# Altium schematic sheet PowerB.SchDoc
size A
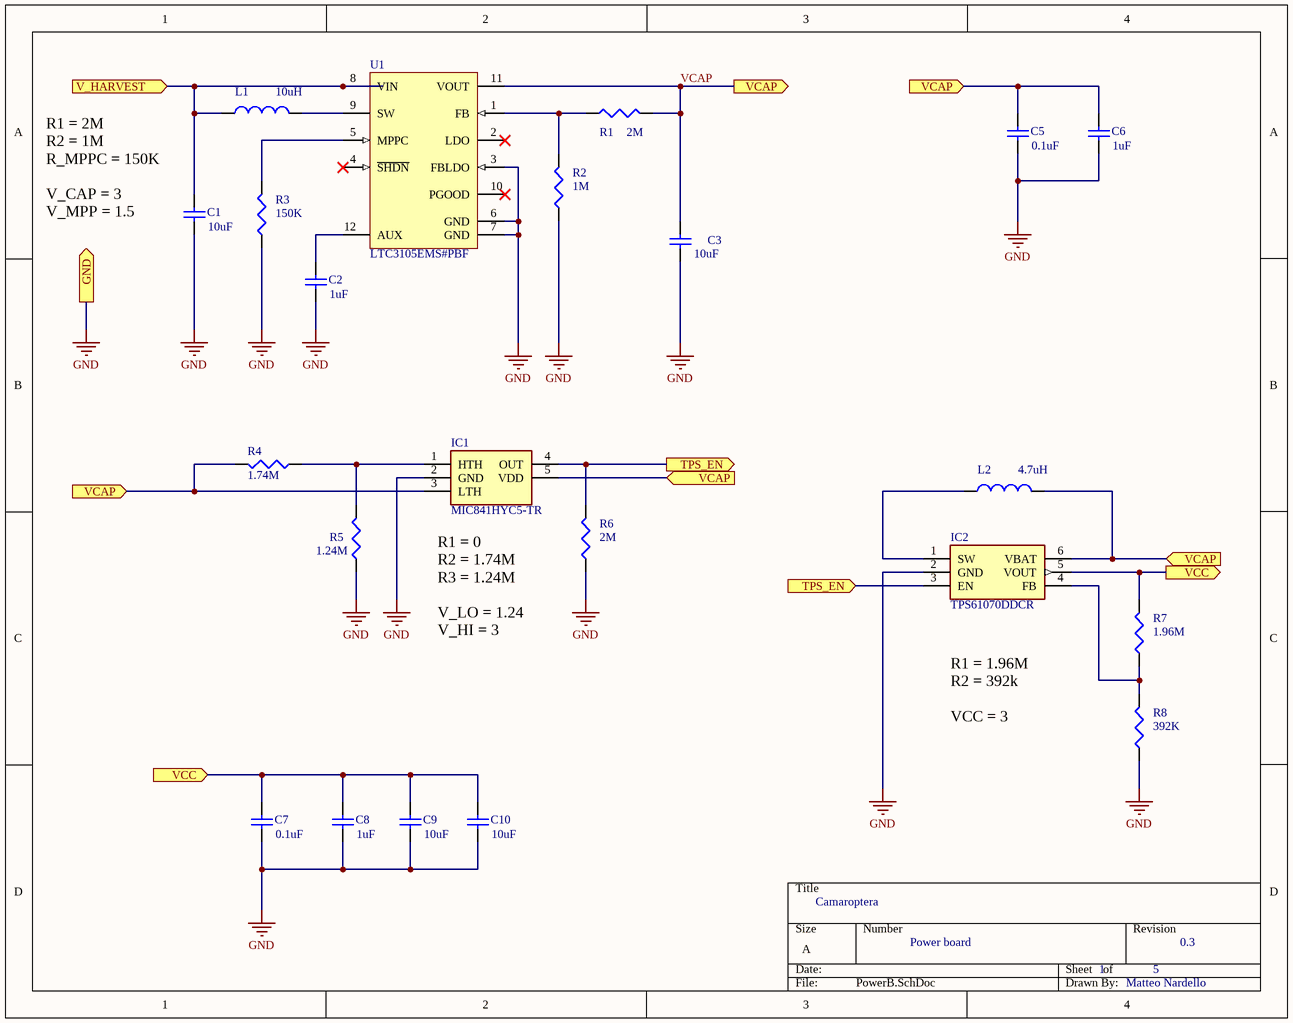
[diagram p0: PowerB.SchDoc]

## Parts
C1  value 10uF  [1608[0603]]  (hidden comment: Cap)
C2  value 1uF  [1608[0603]]  (hidden comment: Cap)
C3  value 10uF  [1608[0603]]  (hidden comment: Cap)
C5  value 0.1uF  [1608[0603]]  (hidden comment: Cap)
C6  value 1uF  [1608[0603]]  (hidden comment: Cap)
C7  value 0.1uF  [1608[0603]]  (hidden comment: Cap)
C8  value 1uF  [1608[0603]]  (hidden comment: Cap)
C9  value 10uF  [1608[0603]]  (hidden comment: Cap)
C10  value 10uF  [1608[0603]]  (hidden comment: Cap)
IC1  MIC841HYC5-TR  [SOT65P210X110-5N]
IC2  TPS61070DDCR  [SOT95P280X110-6N]
L1  value 10uH  [C1210]  (hidden comment: Inductor)
L2  value 4.7uH  [C1210]  (hidden comment: Inductor)
R1  value 2M  [1608[0603]]  (hidden comment: Res3)
R2  value 1M  [1608[0603]]  (hidden comment: Res3)
R3  value 150K  [1608[0603]]  (hidden comment: Res3)
R4  value 1.74M  [1608[0603]]  (hidden comment: Res3)
R5  value 1.24M  [1608[0603]]  (hidden comment: Res3)
R6  value 2M  [1608[0603]]  (hidden comment: Res3)
R7  value 1.96M  [1608[0603]]  (hidden comment: Res3)
R8  value 392K  [1608[0603]]  (hidden comment: Res3)
U1  LTC3105EMS#PBF  [LT-MS-12_N]

## Ports
GND (out), TPS_EN (in), TPS_EN (out), V_HARVEST (in), VCAP (in), VCAP (out), VCC (in), VCC (out)

## Nets
GND: C1.1 C2.1 C3.1 C5.1 C6.1 C7.1 C8.1 C9.1 C10.1 IC1.2(GND) IC2.2(GND) R2.1 R3.1 R5.1 R6.1 R8.1 U1.3(FBLDO) U1.6(GND) U1.7(GND) ; port GND
TPS_EN: IC1.4(OUT) IC2.3(EN) R6.2 ; port TPS_EN
V_HARVEST: C1.2 L1.1 U1.8(VIN) ; port V_HARVEST
VCAP: C3.2 C5.2 C6.2 IC1.3(LTH) IC1.5(VDD) IC2.6(VBAT) L2.2 R1.2 R4.2 U1.11(VOUT) ; port VCAP
VCC: C7.2 C8.2 C9.2 C10.2 IC2.5(VOUT) R7.2 ; port VCC
NetC2_2: C2.2 U1.12(AUX)
NetIC1_1: IC1.1(HTH) R4.1 R5.2
NetIC2_1: IC2.1(SW) L2.1
NetIC2_4: IC2.4(FB) R7.1 R8.2
NetL1_2: L1.2 U1.9(SW)
NetR1_1: R1.1 R2.2 U1.1(FB)
NetR3_2: R3.2 U1.5(MPPC)

Not connected (* = marked no-connect by the designer): U1 2(LDO)* 4(~{SHDN})* 10(PGOOD)*

## Notes on the sheet
- (near C1) R1 = 2M
  R2 = 1M
  R_MPPC = 150K
  V_CAP = 3
  V_MPP = 1.5
- R1 = 0
  R2 = 1.74M
  R3 = 1.24M
  V_LO = 1.24
  V_HI = 3
- R1 = 1.96M
  R2 = 392k
  VCC = 3
- Camaroptera
- Power board
- 1
- 5
- 0.3
- Matteo Nardello

## Library data of the parts
C1-C3 C5-C10 = Cap: CAP CER 6.3V X5R/X7R 0603; PackageReference: 0603; Publisher: Altium Limited; PackageDescription: Chip Capacitor, Body 1.6x0.8mm, IPC High Density
IC1 = MIC841HYC5-TR: Comparator with 1.25% Reference and Adjustable Hysteresis; Manufacturer_Name: Microchip; Datasheet Link: http://ww1.microchip.com/downloads/en/devicedoc/20005758a.pdf; Height: 1.1mm; Manufacturer_Part_Number: MIC841HYC5-TR; Mouser Part Number: 998-MIC841HYC5TR; RS Part Number: 1654292; RS Price/Stock: http://uk.rs-online.com/web/p/products/1654292; ComponentLink1Description: Datasheet; ComponentLink1URL: http://ww1.microchip.com/downloads/en/devicedoc/20005758a.pdf; ComponentLink2Description: Package Specification; ComponentLink2URL: http://94.251.15.129/chip/ChipDoc.nsf/Package/4907A36056EE3CAB47257B96006A2837!OpenDocument; ComponentLink3Description: Manufacturer URL; ComponentLink3URL: https://www.microchip.com
IC2 = TPS61070DDCR: 90% Efficient Synchronous Boost Converter With 600-mA Switch; Manufacturer_Name: Texas Instruments; Datasheet Link: http://www.ti.com/lit/ds/symlink/tps61070.pdf; Height: 1.1mm; Mouser Part Number: 595-TPS61070DDCR; Mouser Price/Stock: https://www.mouser.com/Search/Refine.aspx?Keyword=595-TPS61070DDCR; Manufacturer_Part_Number: TPS61070DDCR; ComponentLink1Description: Manufacturer URL; ComponentLink1URL: www.ti.com; ComponentLink2Description: Package Specification; ComponentLink2URL: http://www.ti.com/lit/ml/mpds026l/mpds026l.pdf; ComponentLink3Description: Datasheet; ComponentLink3URL: http://www.ti.com/lit/ds/symlink/tps61070.pdf
L1 = Inductor: Part: CBC3225T100KR; Code_IEC: 3225; Published: 8-Jun-2000; LatestRevisionDate: 29-May-2009; LatestRevisionNote: IPC-7351 Footprint Added.; PackageReference: 1210; Publisher: Altium Limited; PackageDescription: Chip Inductor; Code_JEITA: 1210
L2 = Inductor: Part: CBC3225T4R7MR; Code_IEC: 3225; Published: 8-Jun-2000; LatestRevisionDate: 29-May-2009; LatestRevisionNote: IPC-7351 Footprint Added.; PackageReference: 1210; Publisher: Altium Limited; PackageDescription: Chip Inductor; Code_JEITA: 1210
R1-R8 = Res3: RES 1/10W 1% 0603 SMD; PackageReference: 0603; Publisher: Altium Limited; PackageDescription: Chip Resistor, Body 1.6x0.8mm, IPC High Density
U1 = CMP-0473-00104-1: 400 mA Step-Up DC/DC Converter with Maximum Power Point Control and 250 mV Start-Up, 12-pin SOP (MS-12), -40 to 85 degC, Pb-Free; Manufacturer: Linear Technology; Number of Outputs: 1; Vin Min(V): 0.225; Topology: Boost; Vin Max(V): 5; Vout Max(V): 5.25; Energy Source: Solar; Mounting Technology: Surface Mount; PackageVersion: Rev. A, 05/2013; PartNumber: LTC3105EMS#PBF; RoHS: TRUE; PackageDescription: 12-Pin Plastic MSOP, Body 4.039 x 3 mm, Pitch 0.65 mm; ComponentLink1Description: Manufacturer URL; DatasheetVersion: Rev. A; ComponentLink1URL: http://www.linear.com/; ComponentLink3Description: Package Specification; ComponentLink2URL: https://www.analog.com/media/en/technical-documentation/data-sheets/3105fb.pdf; ComponentLink3URL: http://cds.linear.com/docs/en/packaging/05081668_A_MS12.pdf; PackageReference: MS-12; ComponentLink2Description: Datasheet